# Altium project WiirdFlex Bottom.PrjPcb
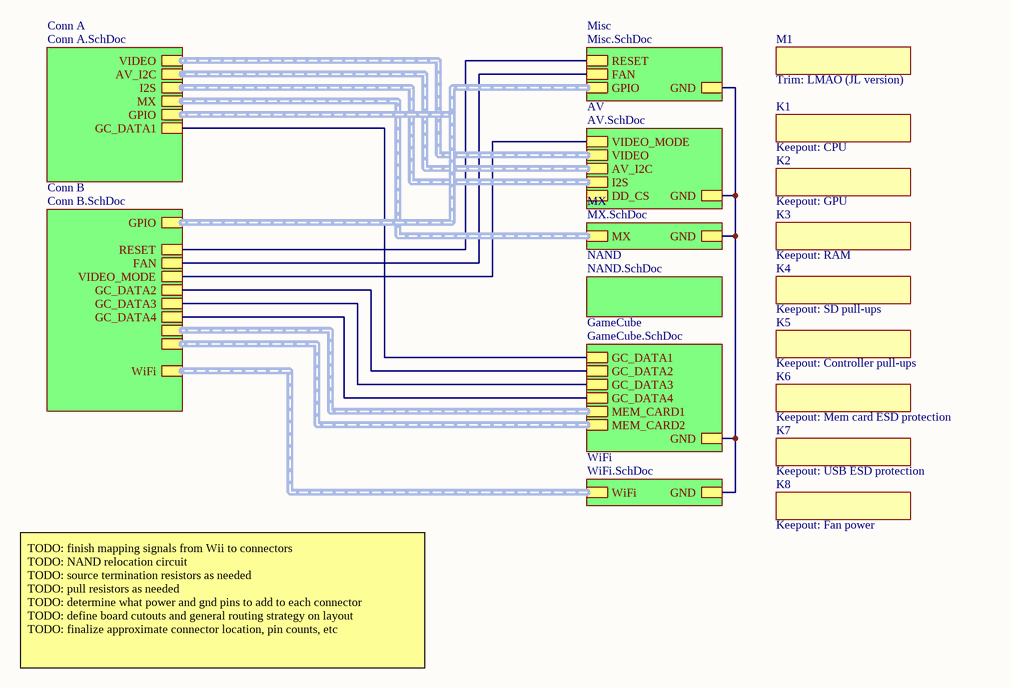
[diagram p0: WiirdFlex Bottom.SchDoc]
7 sheets, 21 parts. Net scope: hierarchical (ports join the sheet entries above them; power ports are global).
Board file: WiirdFlex Bottom.PcbDoc
Sheets:
  WiirdFlex Bottom.SchDoc
    Misc = Misc.SchDoc
    AV = AV.SchDoc
    MX = MX.SchDoc
    NAND = NAND.SchDoc
    WiFi = WiFi.SchDoc
    GameCube = GameCube.SchDoc

## Sheet WiirdFlex Bottom.SchDoc
size A; SheetNumber: 1; SheetTotal: 7

### Parts
K1  Keepout: CPU  [RVK-1_Bottom_Keepout_CPU]
K2  Keepout: GPU  [RVK-1_Bottom_Keepout_GPU]
K3  Keepout: RAM  [RVK-1_Bottom_Keepout_RAM]
K4  Keepout: SD pull-ups  [RVK-1_Bottom_Keepout_SD_Pullups]
K5  Keepout: Controller pull-ups  [RVK-1_Bottom_Keepout_Controller_Pullups]
K6  Keepout: Mem card ESD protection  [RVK-1_Bottom_Keepout_MemCard_ESD]
K7  Keepout: USB ESD protection  [RVK-1_Bottom_Keepout_USB_ESD]
K8  Keepout: Fan power  [RVK-1_Bottom_Keepout_Fan_Power]
M1  Trim: LMAO (JL version)  [Wii Trim: LMAO with extra mounting hole]

### Sub-sheets
AV = AV.SchDoc: VIDEO_MODE, GND, VIDEO (harness VIDEO), AV_I2C (harness I2C), I2S (harness I2S), DD_CS
Conn A = Conn A.SchDoc (file not in this document): VIDEO, AV_I2C, I2S, MX, GPIO, GC_DATA1
Conn B = Conn B.SchDoc (file not in this document): GPIO, RESET, FAN, VIDEO_MODE, GC_DATA2, GC_DATA3, GC_DATA4, , , WiFi
GameCube = GameCube.SchDoc: MEM_CARD1 (harness MEM_CARD), MEM_CARD2 (harness MEM_CARD), GC_DATA4, GND, GC_DATA1, GC_DATA3, GC_DATA2
Misc = Misc.SchDoc: GND, GPIO (harness GPIO), RESET, FAN
MX = MX.SchDoc: MX (harness MX), GND
NAND = NAND.SchDoc: no entries
WiFi = WiFi.SchDoc: WiFi (harness WiFi), GND

### Nets
NetJ1_G: sheet Misc/GND, sheet AV/GND, sheet MX/GND, sheet WiFi/GND, sheet GameCube/GND
NetJ3_1: sheet Misc/RESET, sheet Conn B/RESET
NetJ4_1: sheet Misc/FAN, sheet Conn B/FAN
NetJ6_1: sheet AV/VIDEO_MODE, sheet Conn B/VIDEO_MODE
NetJ10_1: sheet GameCube/GC_DATA1, sheet Conn A/GC_DATA1
NetJ10_2: sheet GameCube/GC_DATA2, sheet Conn B/GC_DATA2
NetJ10_3: sheet GameCube/GC_DATA3, sheet Conn B/GC_DATA3
NetJ10_4: sheet GameCube/GC_DATA4, sheet Conn B/GC_DATA4

### Buses and harness runs
harness sheet AV/AV_I2C = sheet Conn A/AV_I2C
harness sheet AV/I2S = sheet Conn A/I2S
harness sheet AV/VIDEO = sheet Conn A/VIDEO
harness sheet Conn A/GPIO = sheet Conn B/GPIO = sheet Misc/GPIO
harness sheet Conn A/MX = sheet MX/MX
harness sheet Conn B/ = sheet GameCube/MEM_CARD1
harness sheet Conn B/ = sheet GameCube/MEM_CARD2
harness sheet Conn B/WiFi = sheet WiFi/WiFi

### Notes on the sheet
- TODO: finish mapping signals from Wii to connectors
  TODO: NAND relocation circuit
  TODO: source termination resistors as needed
  TODO: pull resistors as needed
  TODO: determine what power and gnd pins to add to each connector
  TODO: define board cutouts and general routing strategy on layout
  TODO: finalize approximate connector location, pin counts, etc

### Library data of the parts
K1-K8 M1 = Misc: placeholder for footprints without pads - keepouts, trim outlines, etc; ClassName: Keepout

## Sheet Misc.SchDoc
size A; SheetNumber: 2; SheetTotal: 7
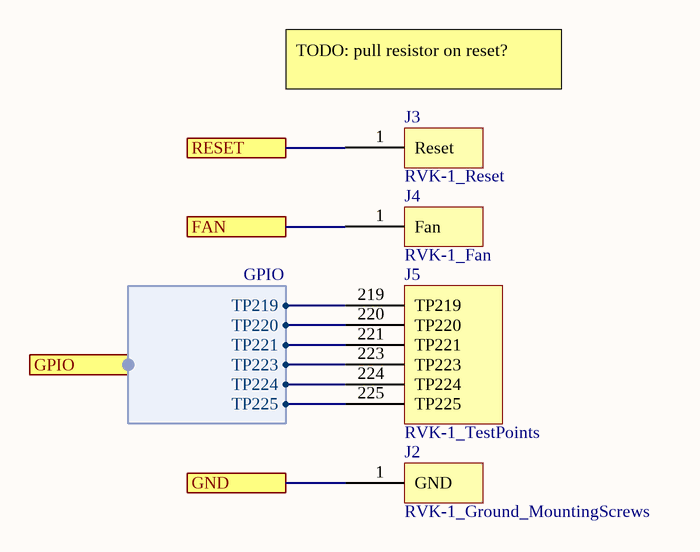
[diagram p1: Misc.SchDoc]

### Parts
J2  RVK-1_Ground_MountingScrews  [RVK-1_GND_Screws - LMAO with extra screwpost]
J3  RVK-1_Reset  [RVK-1_Reset]
J4  RVK-1_Fan  [RVK-1_Fan_PWM]
J5  RVK-1_TestPoints  [RVK-1_TestPoint_Vias]

### Ports
FAN, GND, GPIO (harness GPIO), RESET

### Harnesses
GPIO: TP219, TP220, TP221, TP223, TP224, TP225

### Nets
NetJ1_G: J2.1(GND) ; port GND
NetJ3_1: J3.1(Reset) ; port RESET
NetJ4_1: J4.1(Fan) ; port FAN
NetJ5_219: J5.219(TP219) ; port GPIO.TP219
NetJ5_220: J5.220(TP220) ; port GPIO.TP220
NetJ5_221: J5.221(TP221) ; port GPIO.TP221
NetJ5_223: J5.223(TP223) ; port GPIO.TP223
NetJ5_224: J5.224(TP224) ; port GPIO.TP224
NetJ5_225: J5.225(TP225) ; port GPIO.TP225

### Notes on the sheet
- (near J3) TODO: pull resistor on reset?

## Sheet AV.SchDoc
size A; SheetNumber: 3; SheetTotal: 7
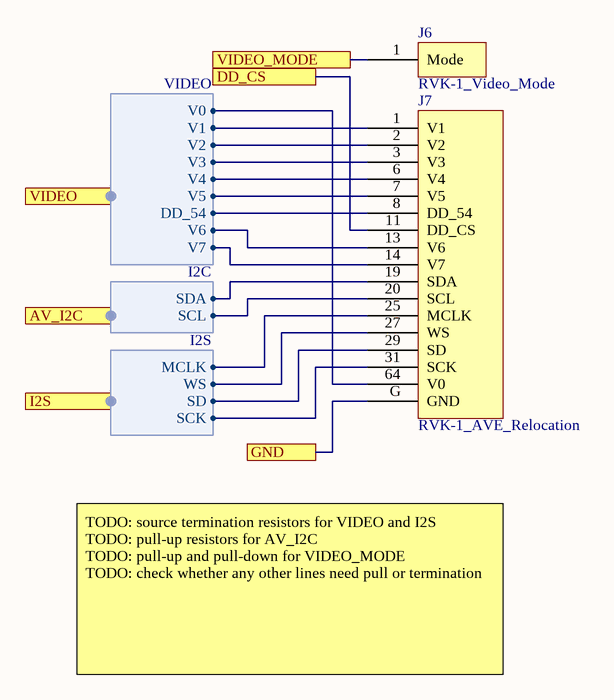
[diagram p2: AV.SchDoc]

### Parts
J6  RVK-1_Video_Mode  [RVK-1_Video_Mode_via]
J7  RVK-1_AVE_Relocation  [RVK-1_AVE_Vias]

### Ports
AV_I2C (harness I2C), DD_CS, GND, I2S (harness I2S), VIDEO (harness VIDEO), VIDEO_MODE

### Harnesses
VIDEO: V0, V1, V2, V3, V4, V5, V6, V7, DD_54
I2C: SDA, SCL
I2S: MCLK, SCK, WS, SD

### Nets
NetJ1_G: J7.G(GND) ; port GND
NetJ6_1: J6.1(Mode) ; port VIDEO_MODE
NetJ7_1: J7.1(V1) ; port VIDEO.V1
NetJ7_2: J7.2(V2) ; port VIDEO.V2
NetJ7_3: J7.3(V3) ; port VIDEO.V3
NetJ7_6: J7.6(V4) ; port VIDEO.V4
NetJ7_7: J7.7(V5) ; port VIDEO.V5
NetJ7_8: J7.8(DD_54) ; port VIDEO.DD_54
NetJ7_11: J7.11(DD_CS) ; port DD_CS
NetJ7_13: J7.13(V6) ; port VIDEO.V6
NetJ7_14: J7.14(V7) ; port VIDEO.V7
NetJ7_19: J7.19(SDA) ; port AV_I2C.SDA
NetJ7_20: J7.20(SCL) ; port AV_I2C.SCL
NetJ7_25: J7.25(MCLK) ; port I2S.MCLK
NetJ7_27: J7.27(WS) ; port I2S.WS
NetJ7_29: J7.29(SD) ; port I2S.SD
NetJ7_31: J7.31(SCK) ; port I2S.SCK
NetJ7_64: J7.64(V0) ; port VIDEO.V0

### Notes on the sheet
- TODO: source termination resistors for VIDEO and I2S
  TODO: pull-up resistors for AV_I2C
  TODO: pull-up and pull-down for VIDEO_MODE
  TODO: check whether any other lines need pull or termination

## Sheet MX.SchDoc
size A; SheetNumber: 4; SheetTotal: 7
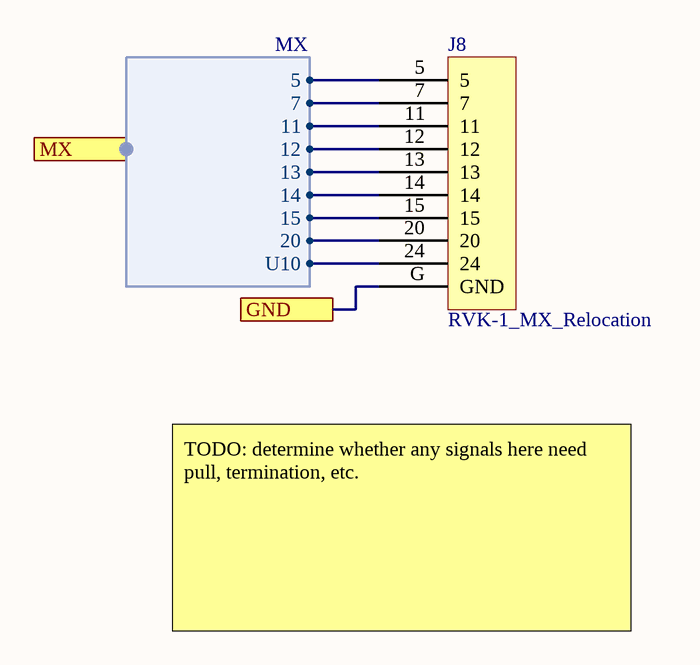
[diagram p3: MX.SchDoc]

### Parts
J8  RVK-1_MX_Relocation  [RVK-1_MX]

### Ports
GND, MX (harness MX)

### Harnesses
MX: 5, 7, 11, 12, 13, 14, 15, 20, U10

### Nets
NetJ1_G: J8.G(GND) ; port GND
NetJ8_5: J8.5 ; port MX.5
NetJ8_7: J8.7 ; port MX.7
NetJ8_11: J8.11 ; port MX.11
NetJ8_12: J8.12 ; port MX.12
NetJ8_13: J8.13 ; port MX.13
NetJ8_14: J8.14 ; port MX.14
NetJ8_15: J8.15 ; port MX.15
NetJ8_20: J8.20 ; port MX.20
NetJ8_24: J8.24 ; port MX.U10

### Notes on the sheet
- TODO: determine whether any signals here need pull, termination, etc.

## Sheet NAND.SchDoc
size A; SheetNumber: 5; SheetTotal: 7
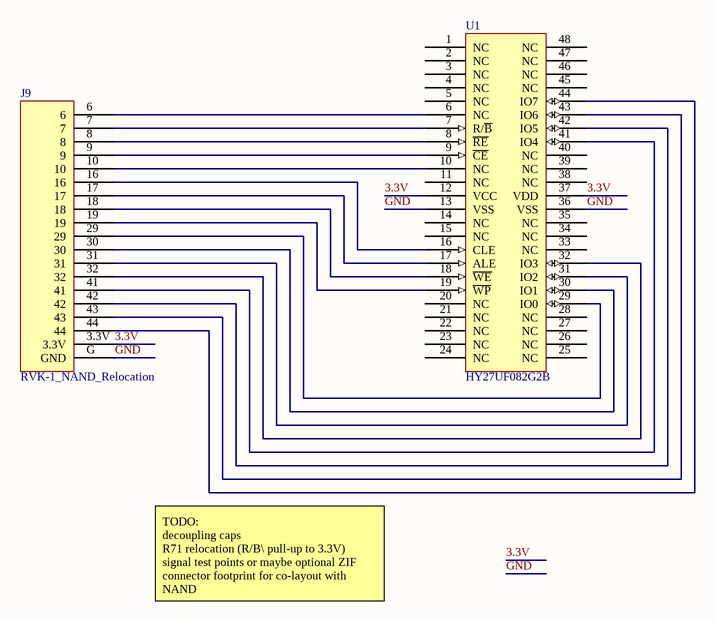
[diagram p4: NAND.SchDoc]

### Parts
J9  RVK-1_NAND_Relocation  [RVK-1_NAND_Vias]
U1  HY27UF082G2B  [TSSOP50P2000X120-48N]

### Nets
3.3V: J9.3.3V U1.12(VCC) U1.37(VDD)
GND: J9.G(GND) U1.13(VSS) U1.36(VSS)
NetJ9_6: J9.6 U1.6(NC)
NetJ9_7: J9.7 U1.7(R/~{B})
NetJ9_8: J9.8 U1.8(~{RE})
NetJ9_9: J9.9 U1.9(~{CE})
NetJ9_10: J9.10 U1.10(NC)
NetJ9_16: J9.16 U1.16(CLE)
NetJ9_17: J9.17 U1.17(ALE)
NetJ9_18: J9.18 U1.18(~{WE})
NetJ9_19: J9.19 U1.19(~{WP})
NetJ9_29: J9.29 U1.29(IO0)
NetJ9_30: J9.30 U1.30(IO1)
NetJ9_31: J9.31 U1.31(IO2)
NetJ9_32: J9.32 U1.32(IO3)
NetJ9_41: J9.41 U1.41(IO4)
NetJ9_42: J9.42 U1.42(IO5)
NetJ9_43: J9.43 U1.43(IO6)
NetJ9_44: J9.44 U1.44(IO7)

Not connected (* = marked no-connect by the designer): U1 1(NC) 2(NC) 3(NC) 4(NC) 5(NC) 11(NC) 14(NC) 15(NC) 20(NC) 21(NC) 22(NC) 23(NC) 24(NC) 25(NC) 26(NC) 27(NC) 28(NC) 33(NC) 34(NC) 35(NC) 38(NC) 39(NC) 40(NC) 45(NC) 46(NC) 47(NC) 48(NC)

### Notes on the sheet
- TODO:
  decoupling caps
  R71 relocation (R/B\ pull-up to 3.3V)
  signal test points or maybe optional ZIF connector footprint for co-layout with NAND

### Library data of the parts
U1 = HY27UF082G2B: NAND flash chip used on WII

## Sheet WiFi.SchDoc
size A; SheetNumber: 7; SheetTotal: 7
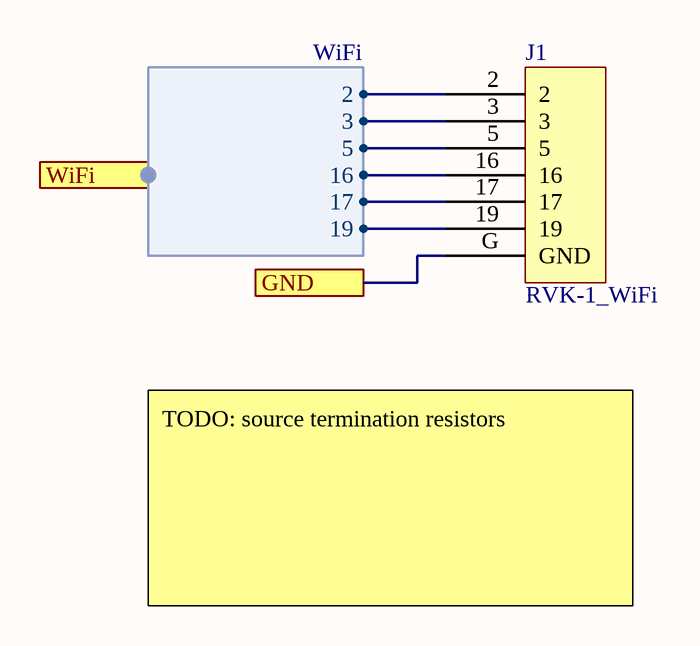
[diagram p5: WiFi.SchDoc]

### Parts
J1  RVK-1_WiFi  [RVK-1_WiFi_Vias]

### Ports
GND, WiFi (harness WiFi)

### Harnesses
WiFi: 2, 3, 5, 16, 17, 19

### Nets
NetJ1_2: J1.2 ; port WiFi.2
NetJ1_3: J1.3 ; port WiFi.3
NetJ1_5: J1.5 ; port WiFi.5
NetJ1_16: J1.16 ; port WiFi.16
NetJ1_17: J1.17 ; port WiFi.17
NetJ1_19: J1.19 ; port WiFi.19
NetJ1_G: J1.G(GND) ; port GND

### Notes on the sheet
- TODO: source termination resistors

## Sheet GameCube.SchDoc
size A; SheetNumber: 6; SheetTotal: 7
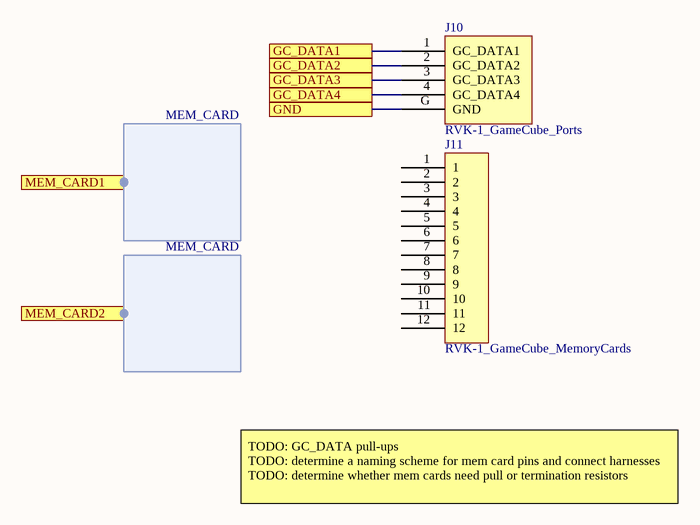
[diagram p6: GameCube.SchDoc]

### Parts
J10  RVK-1_GameCube_Ports  [RVK-1_GC_Controller_Vias]
J11  RVK-1_GameCube_MemoryCards  [RVK-1_MemCard_TestPoints]

### Ports
GC_DATA1, GC_DATA2, GC_DATA3, GC_DATA4, GND, MEM_CARD1 (harness MEM_CARD), MEM_CARD2 (harness MEM_CARD)

### Harnesses
MEM_CARD: 

### Nets
NetJ1_G: J10.G(GND) ; port GND
NetJ10_1: J10.1(GC_DATA1) ; port GC_DATA1
NetJ10_2: J10.2(GC_DATA2) ; port GC_DATA2
NetJ10_3: J10.3(GC_DATA3) ; port GC_DATA3
NetJ10_4: J10.4(GC_DATA4) ; port GC_DATA4

Not connected (* = marked no-connect by the designer): J11 1 2 3 4 5 6 7 8 9 10 11 12

### Notes on the sheet
- TODO: GC_DATA pull-ups
  TODO: determine a naming scheme for mem card pins and connect harnesses
  TODO: determine whether mem cards need pull or termination resistors

## Nets that join several sheets
NetJ1_G: Misc (J2.1), AV (J7.G), MX (J8.G), WiFi (J1.G), GameCube (J10.G)